# EAGLE design bicicletta-sensor (EAGLE 6.1)
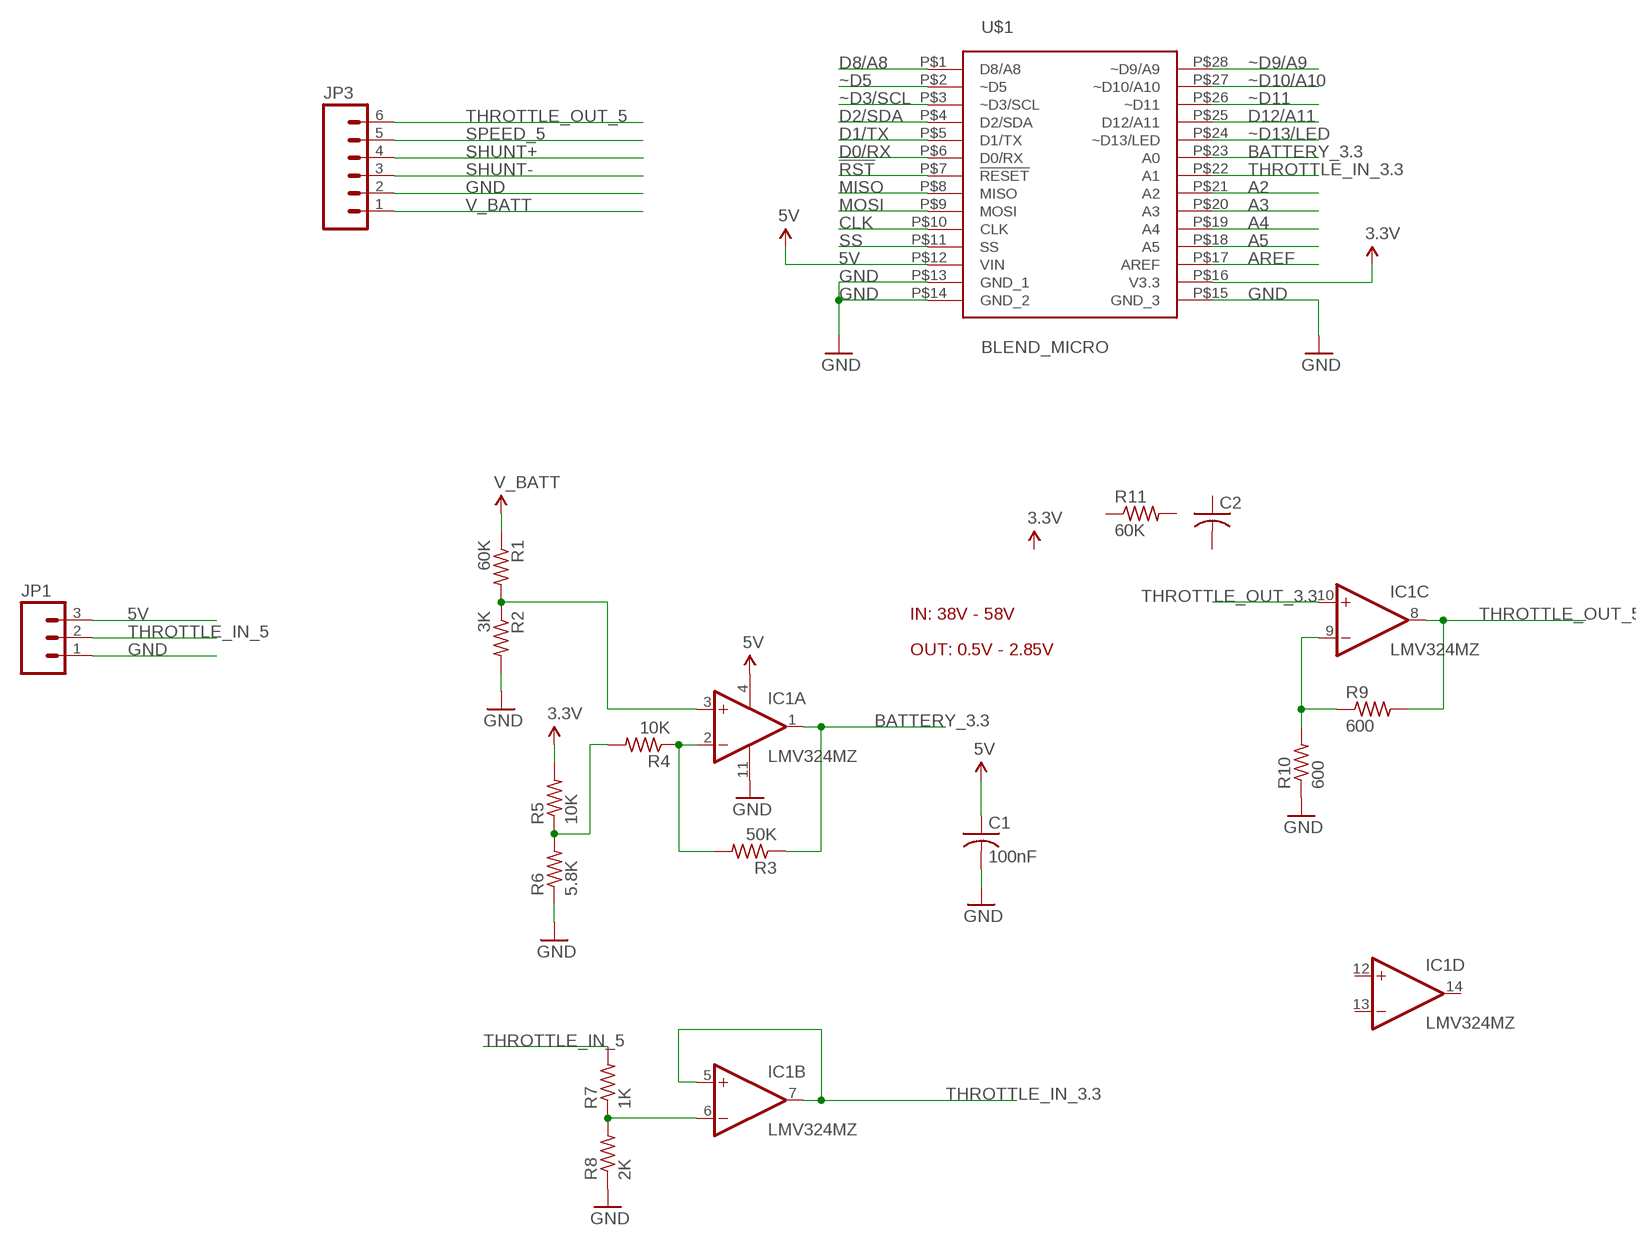
[diagram p0: schematic, sheet 1]

## Parts
C1  100nF  C-USC0603  [C0603]
C2  C-USC0603  [C0603]
IC1  LMV324MZ  [TSSOP14]
JP1  M03PTH  [1X03]
JP3  M06SIP  [1X06]
R1  60K  R-US_R0603  [R0603]
R2  3K  R-US_R0603  [R0603]
R3  50K  R-US_R0603  [R0603]
R4  10K  R-US_R0603  [R0603]
R5  10K  R-US_R0603  [R0603]
R6  5.8K  R-US_R0603  [R0603]
R7  1K  R-US_R0603  [R0603]
R8  2K  R-US_R0603  [R0603]
R9  600  R-US_R0603  [R0603]
R10  600  R-US_R0603  [R0603]
R11  60K  R-US_R0603  [R0603]
U$1  BLEND_MICRO  [BLEND_MICRO]

## Nets
3.3V: R5.2 U$1.P$16(V3.3)
5V: C1.1 IC1.4(P:V+) JP1.3 U$1.P$12(VIN)
!RST: U$1.P$7(!RESET)
A2: U$1.P$21(A2)
A3: U$1.P$20(A3)
A4: U$1.P$19(A4)
A5: U$1.P$18(A5)
AREF: U$1.P$17(AREF)
BATTERY_3.3: IC1.1(A:OUT) R3.1 U$1.P$23(A0)
BIAS: R4.2 R5.1 R6.2
CLK: U$1.P$10(CLK)
D0/RX: U$1.P$6(D0/RX)
D1/TX: U$1.P$5(D1/TX)
D2/SDA: U$1.P$4(D2/SDA)
D8/A8: U$1.P$1(D8/A8)
D12/A11: U$1.P$25(D12/A11)
GND: C1.2 IC1.11(P:V-) JP1.1 JP3.2 R2.2 R6.1 R8.1 R10.1 U$1.P$13(GND_1) U$1.P$14(GND_2) U$1.P$15(GND_3)
MISO: U$1.P$8(MISO)
MOSI: U$1.P$9(MOSI)
N$1: IC1.9(C:-IN) R9.1 R10.2
N$2: IC1.3(A:+IN) R1.2 R2.1
N$3: IC1.2(A:-IN) R3.2 R4.1
N$11: IC1.6(B:-IN) R7.1 R8.2
SHUNT+: JP3.4
SHUNT-: JP3.3
SPEED_5: JP3.5
SS: U$1.P$11(SS)
THROTTLE_IN_3.3: IC1.5(B:+IN) IC1.7(B:OUT) U$1.P$22(A1)
THROTTLE_IN_5: JP1.2 R7.2
THROTTLE_OUT_3.3: IC1.10(C:+IN)
THROTTLE_OUT_5: IC1.8(C:OUT) JP3.6 R9.2
V_BATT: JP3.1 R1.1
~D3/SCL: U$1.P$3(~D3/SCL)
~D5: U$1.P$2(~D5)
~D9/A9: U$1.P$28(~D9/A9)
~D10/A10: U$1.P$27(~D10/A10)
~D11: U$1.P$26(~D11)
~D13/LED: U$1.P$24(~D13/LED)
Unconnected: C2.1 C2.2 IC1.12(D:+IN) IC1.13(D:-IN) IC1.14(D:OUT) R11.1 R11.2

## Notes on the sheet
- IN: 38V - 58V
- OUT: 0.5V - 2.85V

## Library data of the parts
C1 C2 = rcl:C-US: CAPACITOR, American symbol
IC1 = linear:LMV324?*: Quad General Purpose, Low Voltage, Rail-to-Rail Output Operational Amplifiers Source: http://www.national.com/mpf/LM/LMV321.html http://www.national.com/dt/lmv_qual.pdf
JP1 = SparkFun-Connectors:M03: Header 3 Standard 3-pin 0.1" header. Use with straight break away headers (SKU : PRT-00116), right angle break away headers (PRT-00553), swiss pins (PRT-00743), machine pins (PRT-00117), and female headers (PRT-00115). Molex polarized connector foot print use with SKU : PRT-08232 with associated crimp pins and housings.
JP3 = SparkFun-Connectors:M06: Header 6 Standard 6-pin 0.1" header. Use with straight break away headers (SKU : PRT-00116), right angle break away headers (PRT-00553), swiss pins (PRT-00743), machine pins (PRT-00117), and female headers (PRT-00115). Molex polarized connector foot print use with SKU : PRT-08094 with associated crimp pins and housings. NOTES ON THE VARIANTS LOCK and LOCK_LONGPADS... This footprint was designed to help hold the alignment of a through-hole component (i.e. 6-pin header) while soldering it into place. You may notice that each hole has been shifted either up or down by 0.005 of an inch from it's more standard position (which is a perfectly straight line). This slight alteration caused the pins (the squares in the middle) to touch the edges of the holes. Because they are alternating, it causes a "brace" to hold the component in place. 0.005 has proven to be the perfect amount of "off-center" position when using our standard breakaway headers. Although looks a little odd when you look at the bare footprint, once you have a header in there, the alteration is very hard to notice. Also, if you push a header all the way into place, it is covered up entirely on the bottom side. This idea of altering the position of holes to aid alignment will be further integrated into the Sparkfun Library for other footprints. It can help hold any component with 3 or more connection pins.
R1-R11 = rcl:R-US_: RESISTOR, American symbol
U$1 = Railstars:BLEND_MICRO

## Board
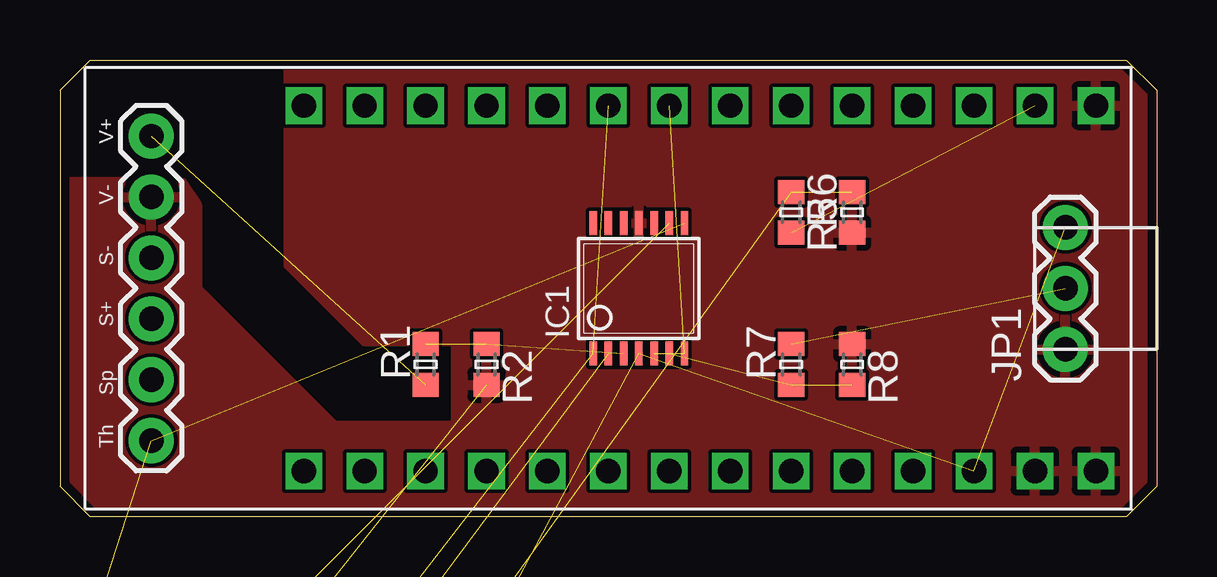
[diagram p1: board, top side]
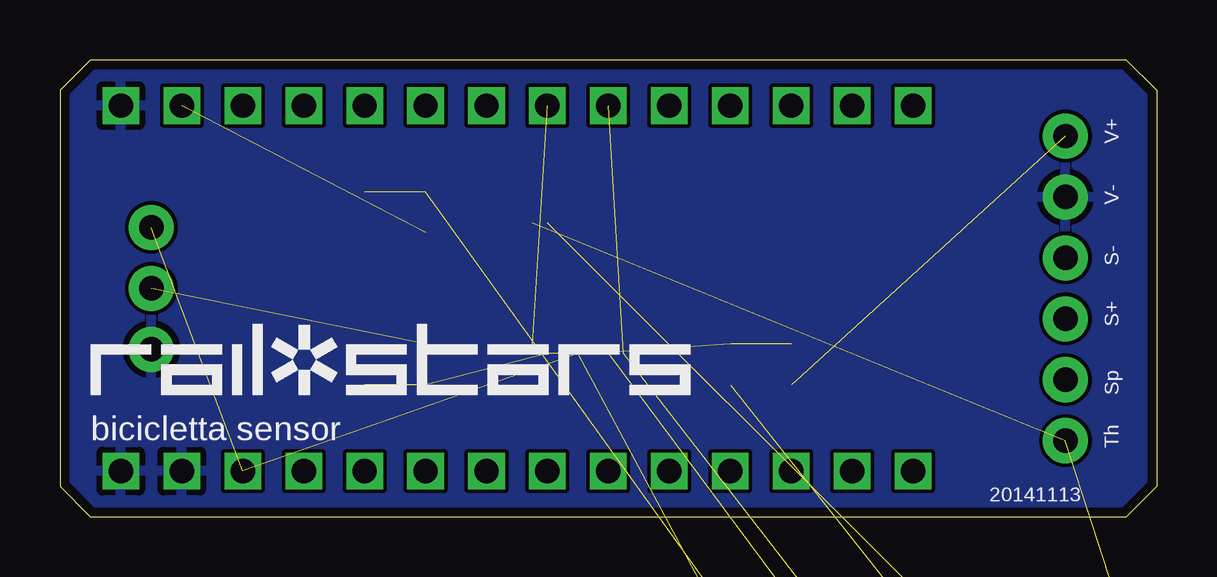
[diagram p2: board, bottom side, seen from below]

Size 45.72 x 19.05 mm. Coordinates in mm from the lower left corner, seen from the top.
Outline: 0,17.78 1.27,19.05 44.45,19.05 45.72,17.78 45.72,1.27 44.45,0 1.27,0 0,1.27 0,17.78
Copper layers (1*16): Top 0.0356mm / dielectric 1.5011mm / Bottom 0.0356mm
Design rules: minimum track width 6mil, minimum drill 13mil, track to track 6mil, track to pad 6mil, pad to pad 6mil, via to via 6mil, smd to smd 6mil, copper to edge 15mil, drill to drill 6mil, minimum pad ring 7mil, minimum via ring 7mil, stop-mask expansion 0mil, vias tented up to drill 200mil, thermal gap 10mil

### Footprints (pad centres in the part's own frame; a part is rotated, then mirrored left to right if it is on the bottom)
C0603 = smd 1.1 x 1: 1 -0.85,0; 2 0.85,0
TSSOP14 = smd 0.305 x 0.991: 1 -1.905,-2.718; 2 -1.27,-2.718; 3 -0.635,-2.718; 4 0,-2.718; 5 0.635,-2.718; 6 1.27,-2.718; 7 1.905,-2.718; 8 1.905,2.718; 9 1.27,2.718; 10 0.635,2.718; 11 0,2.718; 12 -0.635,2.718; 13 -1.27,2.718; 14 -1.905,2.718
1X03 = drill 1.016 pad 1.88: 1 0,0; 2 2.54,0; 3 5.08,0
1X06 = drill 1.016 pad 1.88: 1 0,0; 2 2.54,0; 3 5.08,0; 4 7.62,0; 5 10.16,0; 6 12.7,0
R0603 = smd 1 x 1.1: 1 -0.85,0; 2 0.85,0
BLEND_MICRO = drill 1.016 square: P$1 -7.62,12.7; P$2 -7.62,10.16; P$3 -7.62,7.62; P$4 -7.62,5.08; P$5 -7.62,2.54; P$6 -7.62,0; P$7 -7.62,-2.54; P$8 -7.62,-5.08; P$9 -7.62,-7.62; P$10 -7.62,-10.16; P$11 -7.62,-12.7; P$12 -7.62,-15.24; P$13 -7.62,-17.78; P$14 -7.62,-20.32; P$15 7.62,-20.32; P$16 7.62,-17.78; P$17 7.62,-15.24; P$18 7.62,-12.7; P$19 7.62,-10.16; P$20 7.62,-7.62; P$21 7.62,-5.08; P$22 7.62,-2.54; P$23 7.62,0; P$24 7.62,2.54; P$25 7.62,5.08; P$26 7.62,7.62; P$27 7.62,10.16; P$28 7.62,12.7

### Placement (x,y rotation side)
C1  -3.81,-46.99 0 top  (outside the outline)
C2  -3.81,-43.18 0 top  (outside the outline)
IC1  24.13,9.53 0 top
JP1  41.91,6.99 90 top
JP3  3.81,15.88 270 top
R1  15.24,6.35 90 top
R2  17.78,6.35 270 top
R3  -3.81,-27.94 0 top  (outside the outline)
R4  -3.81,-33.02 0 top  (outside the outline)
R5  30.48,12.7 270 top
R6  33.02,12.7 90 top
R7  30.48,6.35 90 top
R8  33.02,6.35 270 top
R9  -3.81,-17.78 0 top  (outside the outline)
R10  -3.81,-22.86 0 top  (outside the outline)
R11  -3.81,-38.1 0 top  (outside the outline)
U$1  22.86,9.53 90 top
U$2  [RAILSTARS_25MM]  44.45,5.08 0 bottom

### Tracks (layer width: path | path; a pad name or v marks a point on that pad's centre or on a via)
3.3V  (1 unrouted)
5V  (3 unrouted)
BATTERY_3.3  (2 unrouted)
BIAS  (2 unrouted)
GND  (2 unrouted)
  pour Bottom: 0,19.05 45.72,19.05 45.72,0 0,0
  pour Top: 9.53,19.05 45.72,19.05 46.99,0 0,0 0,13.97 5.08,13.97 5.71,13.02 5.71,9.53 11.43,3.81 16.51,3.81 16.51,7.3 12.7,7.3 9.53,10.48
N$1  (2 unrouted)
N$2  (2 unrouted)
N$3  (2 unrouted)
N$11  (2 unrouted)
THROTTLE_IN_3.3  (2 unrouted)
THROTTLE_IN_5  (1 unrouted)
THROTTLE_OUT_5  (2 unrouted)
V_BATT  (1 unrouted)

### Text on the board
tPlace: V+ | V- | S- | S+ | Sp | Th
bPlace: V+ | V- | S- | S+ | Sp | Th | bicicletta sensor | 20141113